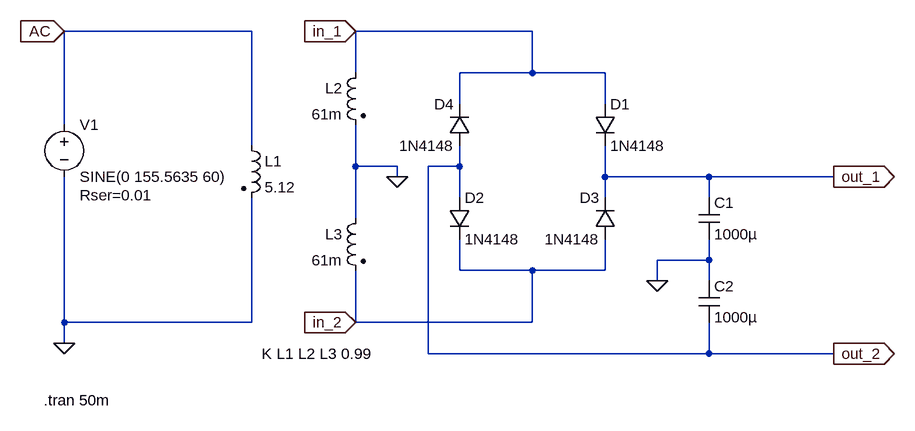
[diagram p0: schematic filter.asc]
filter.asc, the LTspice schematic file:
Version 4
SHEET 1 880 680
WIRE -240 -144 -528 -144
WIRE 192 -144 -80 -144
WIRE -80 -80 -80 -144
WIRE 192 -80 192 -144
WIRE 192 -80 80 -80
WIRE 304 -80 192 -80
WIRE 80 -32 80 -80
WIRE 304 -32 304 -80
WIRE -528 0 -528 -144
WIRE -240 32 -240 -144
WIRE -80 64 -80 0
WIRE -16 64 -80 64
WIRE 80 64 80 32
WIRE 80 64 32 64
WIRE -16 80 -16 64
WIRE 304 80 304 32
WIRE 464 80 304 80
WIRE 656 80 464 80
WIRE 80 112 80 64
WIRE 304 112 304 80
WIRE 464 112 464 80
WIRE -80 144 -80 64
WIRE 464 208 464 176
WIRE 464 208 384 208
WIRE 80 224 80 176
WIRE 192 224 80 224
WIRE 304 224 304 176
WIRE 304 224 192 224
WIRE 384 240 384 208
WIRE 464 240 464 208
WIRE -528 304 -528 80
WIRE -240 304 -240 112
WIRE -240 304 -528 304
WIRE -80 304 -80 224
WIRE 192 304 192 224
WIRE 192 304 -80 304
WIRE -528 336 -528 304
WIRE 32 352 32 64
WIRE 464 352 464 304
WIRE 464 352 32 352
WIRE 656 352 464 352
FLAG -528 336 0
FLAG -16 80 0
FLAG -80 -144 in_1
IOPIN -80 -144 In
FLAG -80 304 in_2
IOPIN -80 304 In
FLAG -528 -144 AC
IOPIN -528 -144 In
FLAG 384 240 0
FLAG 656 80 out_1
IOPIN 656 80 Out
FLAG 656 352 out_2
IOPIN 656 352 Out
SYMBOL voltage -528 -16 R0
WINDOW 123 0 0 Left 0
WINDOW 39 24 124 Left 2
SYMATTR SpiceLine Rser=0.01
SYMATTR InstName V1
SYMATTR Value SINE(0 155.5635 60)
SYMBOL ind2 -256 16 R0
SYMATTR InstName L1
SYMATTR Value 5.12
SYMATTR Type ind
SYMBOL ind2 -64 -96 M0
SYMATTR InstName L2
SYMATTR Value 61m
SYMATTR Type ind
SYMBOL ind2 -64 128 M0
SYMATTR InstName L3
SYMATTR Value 61m
SYMATTR Type ind
SYMBOL diode 288 -32 R0
SYMATTR InstName D1
SYMATTR Value 1N4148
SYMBOL diode 64 112 R0
SYMATTR InstName D2
SYMATTR Value 1N4148
SYMBOL diode 320 176 R180
WINDOW 0 24 64 Left 2
WINDOW 3 24 0 Left 2
SYMATTR InstName D3
SYMATTR Value 1N4148
SYMBOL diode 96 32 R180
WINDOW 0 24 64 Left 2
WINDOW 3 24 0 Left 2
SYMATTR InstName D4
SYMATTR Value 1N4148
SYMBOL cap 448 112 R0
SYMATTR InstName C1
SYMATTR Value 1000µ
SYMBOL cap 448 240 R0
SYMATTR InstName C2
SYMATTR Value 1000µ
TEXT -224 352 Left 2 !K L1 L2 L3 0.99
TEXT -560 424 Left 2 !.tran 50m

The netlist it stands for:
* filter.asc
V1 AC 0 SINE(0 155.5635 60) Rser=0.01
L1 AC 0 5.12
L2 in_1 0 61m
L3 0 in_2 61m
D1 in_1 out_1 1N4148
D2 out_2 in_2 1N4148
D3 in_2 out_1 1N4148
D4 out_2 in_1 1N4148
C1 out_1 0 1000µ
C2 0 out_2 1000µ
.model D D
.lib standard.dio
K L1 L2 L3 0.99
.tran 50m
.backanno
.end